# EAGLE design Knives_Controls (EAGLE 9.6.2)
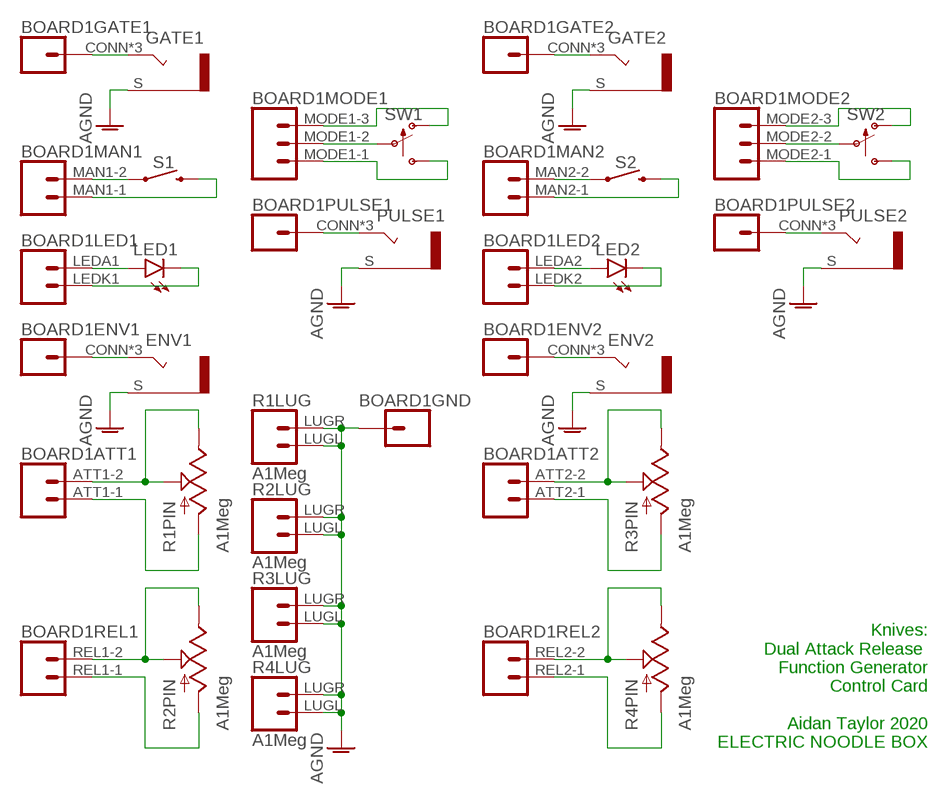
[diagram p0: schematic, sheet 1]

## Parts
BOARD1  KNIVES_LINK  [KNIVES]
ENV1  COMBI-JACKCINCHNANA  [NEWCOMBOJACK_PANEL]
ENV2  COMBI-JACKCINCHNANA  [NEWCOMBOJACK_PANEL]
GATE1  COMBI-JACKCINCHNANA  [NEWCOMBOJACK_PANEL]
GATE2  COMBI-JACKCINCHNANA  [NEWCOMBOJACK_PANEL]
LED1  LED3MM  [LED3MM]
LED2  LED3MM  [LED3MM]
PULSE1  COMBI-JACKCINCHNANA  [NEWCOMBOJACK_PANEL]
PULSE2  COMBI-JACKCINCHNANA  [NEWCOMBOJACK_PANEL]
R1  A1Meg  POTENTIOMETER  [ALPHA_RV09_9MMPOT]
R2  A1Meg  POTENTIOMETER  [ALPHA_RV09_9MMPOT]
R3  A1Meg  POTENTIOMETER  [ALPHA_RV09_9MMPOT]
R4  A1Meg  POTENTIOMETER  [ALPHA_RV09_9MMPOT]
S1  MCDTS-2_PUSHBUTTON  [MCDTS-2_PUSHBUTTON]
S2  MCDTS-2_PUSHBUTTON  [MCDTS-2_PUSHBUTTON]
SW1  SPDT_SWITCHDW1  [MICRODPDT-DW1]
SW2  SPDT_SWITCHDW1  [MICRODPDT-DW1]

## Nets
AGND: BOARD1.GND ENV1.S ENV2.S GATE1.S GATE2.S PULSE1.S PULSE2.S R1.LUGL R1.LUGR R2.LUGL R2.LUGR R3.LUGL R3.LUGR R4.LUGL R4.LUGR
N$1: BOARD1.G1 GATE1.CONN(T) GATE1.T1(T) GATE1.T2(T)
N$2: BOARD1.MAN1-2 S1.P$1 S1.P$2
N$3: BOARD1.MAN1-1 S1.P$3 S1.P$4
N$4: BOARD1.LEDA1 LED1.A
N$5: BOARD1.LEDK1 LED1.K(C)
N$6: BOARD1.EOUT1 ENV1.CONN(T) ENV1.T1(T) ENV1.T2(T)
N$7: BOARD1.ATT1-2 R1.C2(PIN:W) R1.C3(PIN:B)
N$8: BOARD1.ATT1-1 R1.C1(PIN:A)
N$9: BOARD1.REL1-2 R2.C2(PIN:W) R2.C3(PIN:B)
N$10: BOARD1.REL1-1 R2.C1(PIN:A)
N$11: BOARD1.MODE1-1 SW1.C3(S)
N$12: BOARD1.MODE1-2 SW1.C2(P)
N$13: BOARD1.MODE1-3 SW1.C1(O)
N$14: BOARD1.P1 PULSE1.CONN(T) PULSE1.T1(T) PULSE1.T2(T)
N$15: BOARD1.G2 GATE2.CONN(T) GATE2.T1(T) GATE2.T2(T)
N$16: BOARD1.MAN2-2 S2.P$1 S2.P$2
N$17: BOARD1.MAN2-1 S2.P$3 S2.P$4
N$18: BOARD1.LEDA2 LED2.A
N$19: BOARD1.LEDK2 LED2.K(C)
N$20: BOARD1.EOUT2 ENV2.CONN(T) ENV2.T1(T) ENV2.T2(T)
N$21: BOARD1.ATT2-2 R3.C2(PIN:W) R3.C3(PIN:B)
N$22: BOARD1.ATT2-1 R3.C1(PIN:A)
N$23: BOARD1.REL2-2 R4.C2(PIN:W) R4.C3(PIN:B)
N$24: BOARD1.REL2-1 R4.C1(PIN:A)
N$25: BOARD1.MODE2-1 SW2.C3(S)
N$26: BOARD1.MODE2-2 SW2.C2(P)
N$27: BOARD1.MODE2-3 SW2.C1(O)
N$28: BOARD1.P2 PULSE2.CONN(T) PULSE2.T1(T) PULSE2.T2(T)

## Notes on the sheet
- Knives:
  Dual Attack Release 
  Function Generator
  Control Card
  
  Aidan Taylor 2020
  ELECTRIC NOODLE BOX

## Library data of the parts
BOARD1 = ElectricNoodleBox:KNIVES_LINK
ENV1 ENV2 GATE1 GATE2 PULSE1 PULSE2 = ElectricNoodleBox:COMBI-JACK
LED1 LED2 = led:LED: LED OSRAM: - CHIPLED LG R971, LG N971, LY N971, LG Q971, LY Q971, LO R971, LY R971 LH N974, LH R974 LS Q976, LO Q976, LY Q976 LO Q996 - Hyper CHIPLED LW Q18S LB Q993, LB Q99A, LB R99A - SideLED LS A670, LO A670, LY A670, LG A670, LP A670 LB A673, LV A673, LT A673, LW A673 LH A674 LY A675 LS A676, LA A676, LO A676, LY A676, LW A676 LS A679, LY A679, LG A679 - Hyper Micro SIDELED® LS Y876, LA Y876, LO Y876, LY Y876 LT Y87S - SmartLED LW L88C, LW L88S LB L89C, LB L89S, LG L890 LS L89K, LO L89K, LY L89K LS L896, LA L896, LO L896, LY L896 - TOPLED LS T670, LO T670, LY T670, LG T670, LP T670 LSG T670, LSP T670, LSY T670, LOP T670, LYG T670 LG T671, LOG T671, LSG T671 LB T673, LV T673, LT T673, LW T673 LH T674 LS T676, LA T676, LO T676, LY T676, LB T676, LH T676, LSB T676, LW T676 LB T67C, LV T67C, LT T67C, LS T67K, LO T67K, LY T67K, LW E67C LS E67B, LA E67B, LO E67B, LY E67B, LB E67C, LV E67C, LT E67C LW T67C LS T679, LY T679, LG T679 LS T770, LO T770, LY T770, LG T770, LP T770 LB T773, LV T773, LT T773, LW T773 LH T774 LS E675, LA E675, LY E675, LS T675 LS T776, LA T776, LO T776, LY T776, LB T776 LHGB T686 LT T68C, LB T68C - Hyper Mini TOPLED® LB M676 - Mini TOPLED Santana® LG M470 LS M47K, LO M47K, LY M47K Source: http://www.osram.convergy.de LUXEON: - LUMILED® LXK2-PW12-R00, LXK2-PW12-S00, LXK2-PW14-U00, LXK2-PW14-V00 LXK2-PM12-R00, LXK2-PM12-S00, LXK2-PM14-U00 LXK2-PE12-Q00, LXK2-PE12-R00, LXK2-PE12-S00, LXK2-PE14-T00, LXK2-PE14-U00 LXK2-PB12-K00, LXK2-PB12-L00, LXK2-PB12-M00, LXK2-PB14-N00, LXK2-PB14-P00, LXK2-PB14-Q00 LXK2-PR12-L00, LXK2-PR12-M00, LXK2-PR14-Q00, LXK2-PR14-R00 LXK2-PD12-Q00, LXK2-PD12-R00, LXK2-PD12-S00 LXK2-PH12-R00, LXK2-PH12-S00 LXK2-PL12-P00, LXK2-PL12-Q00, LXK2-PL12-R00 Source: www.luxeon.com KINGBRIGHT: KA-3528ASYC Source: www.kingbright.com
R1-R4 = ElectricNoodleBox:POTENTIOMETER
S1 S2 = ElectricNoodleBox:MCDTS-2_PUSHBUTTON
SW1 SW2 = ElectricNoodleBox:SPDT_SWITCH

## Board
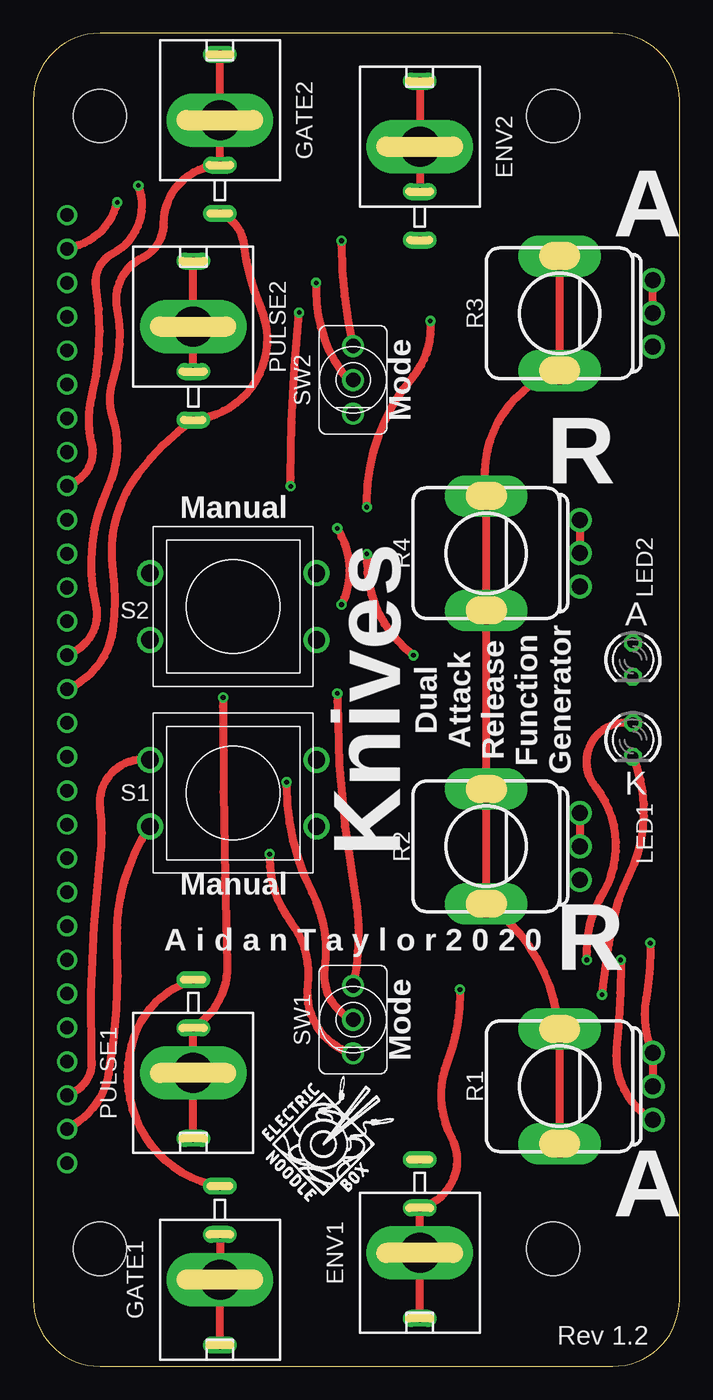
[diagram p1: board, top side]
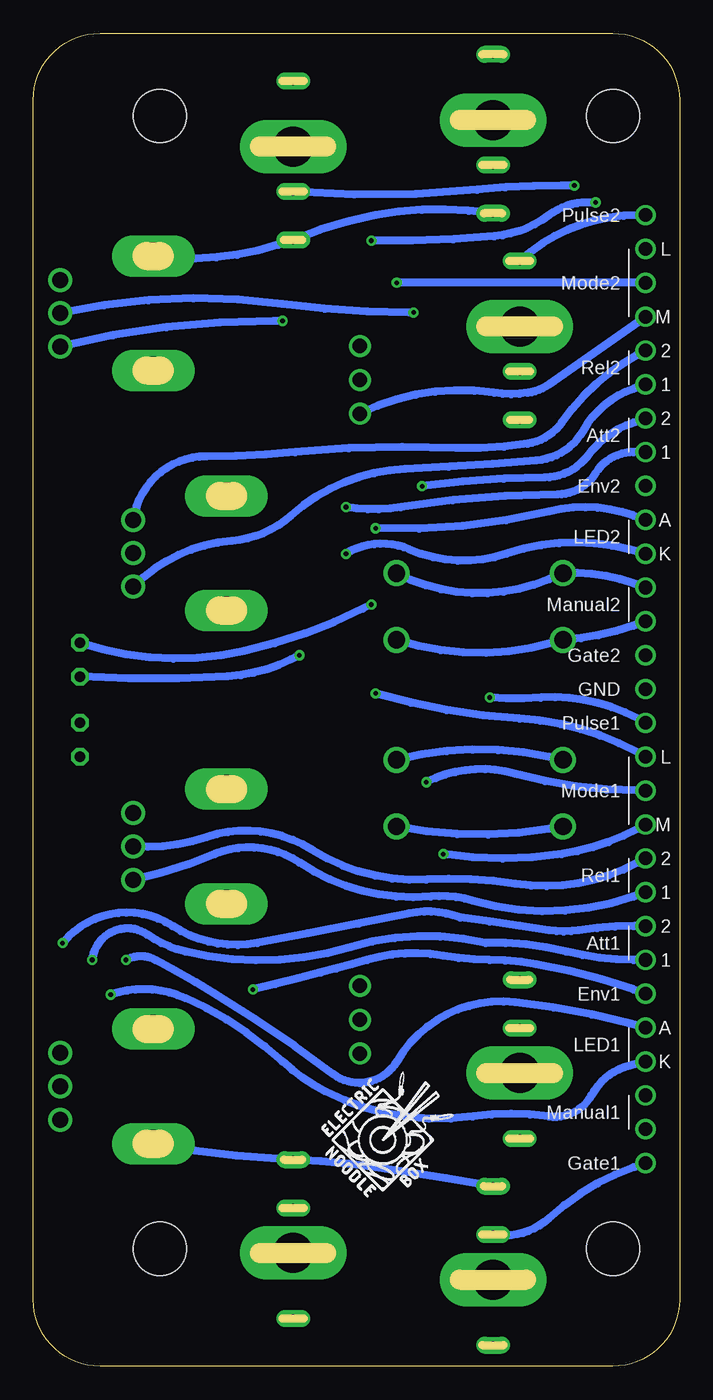
[diagram p2: board, bottom side, seen from below]

Size 48.5 x 100 mm. Coordinates in mm from the lower left corner, seen from the top.
Outline: 48.5,5 48.5,95 arc90 43.5,100 5,100 arc90 0,95 0,5 arc90 5,0 43.5,0 arc90 48.5,5
Copper layers (1*16): Top 0.035mm / dielectric 1.5mm / Bottom 0.035mm
Design rules "default": minimum track width 6mil, minimum drill 0.35mm, track to track 6mil, track to pad 6mil, pad to pad 6mil, via to via 6mil, smd to smd 6mil, copper to edge 40mil, drill to drill 6mil, minimum pad ring 10mil, minimum via ring 8mil, stop-mask expansion 4mil, vias tented up to drill 0mil, thermal gap 10mil

### Footprints (pad centres in the part's own frame; a part is rotated, then mirrored left to right if it is on the bottom)
KNIVES = drill 1.016: ATT1-1 26.67,2.54; ATT1-2 29.21,2.54; ATT2-1 64.77,2.54; ATT2-2 67.31,2.54; EOUT1 24.13,2.54; EOUT2 62.23,2.54; G1 11.43,2.54; G2 49.53,2.54; GND 46.99,2.54; LEDA1 21.59,2.54; LEDA2 59.69,2.54; LEDK1 19.05,2.54; LEDK2 57.15,2.54; MAN1-1 13.97,2.54; MAN1-2 16.51,2.54; MAN2-1 52.07,2.54; MAN2-2 54.61,2.54; MODE1-1 36.83,2.54; MODE1-2 39.37,2.54; MODE1-3 41.91,2.54; MODE2-1 74.93,2.54; MODE2-2 77.47,2.54; MODE2-3 80.01,2.54; P1 44.45,2.54; P2 82.55,2.54; REL1-1 31.75,2.54; REL1-2 34.29,2.54; REL2-1 69.85,2.54; REL2-2 72.39,2.54 | hole 4: 5,5; 90,5; 90,39; 5,39
NEWCOMBOJACK_PANEL = drill 3 pad 3.6 long: CONN 0,0 | drill 0.6 pad 1.27 long: S 0,-7; T1 0,4.92; T2 0,-3.38
LED3MM = drill 0.813 octagon: A -1.27,0; K 1.27,0
ALPHA_RV09_9MMPOT = drill 1.2 pad 1.778: C1 -2.5,-7; C2 0,-7; C3 2.5,-7 | drill 2.1 pad 2.8 long: LUGL -4.3,0; LUGR 4.3,0
MCDTS-2_PUSHBUTTON = drill 1.3: P$1 -6.25,-2.5; P$2 6.25,-2.5; P$3 -6.25,2.5; P$4 6.25,2.5
MICRODPDT-DW1 = drill 1.1: C1 0,-2.54; C2 0,0; C3 0,2.54

### Placement (x,y rotation side)
BOARD1  0,3.81 90 bottom
ENV1  29,8.5 180 top
ENV2  29,91.5 0 top
GATE1  14,6.5 180 top
GATE2  14,93.5 0 top
LED1  45,47 270 top
LED2  45,53 270 top
PULSE1  12,22 180 top
PULSE2  12,78 0 top
R1  39.5,21 90 top
R2  34,39 90 top
R3  39.5,79 90 top
R4  34,61 90 top
S1  15,43 180 top
S2  15,57 180 top
SW1  24,26 180 top
SW2  24,74 180 top
U$1  [LOGO10X10]  17.1,12.06 0 top
U$2  [LOGO10X10]  26.94,12.38 0 bottom

### Tracks (layer width: path | path; a pad name or v marks a point on that pad's centre or on a via)
AGND
  Top 0.61: BOARD1.GND 3.13,51.12 arc54 5.99,55.24 arc16 5.99,59.69 arc-45 7.89,66.99 arc-17 PULSE2.S 12.65,71.12 arc103 17.1,79.38 arc-16 15.83,84.14 arc62 GATE2.S | PULSE1.S 11.06,28.57 arc46 7.57,24.77 arc31 7.26,20 arc68 GATE1.S | R1.LUGL R1.LUGR 39.32,26.35 arc46 R2.LUGL R2.LUGR R4.LUGL R4.LUGR 33.92,66.36 arc-76 R3.LUGL R3.LUGR
  Bottom 0.61: GATE1.S 14.88,13.65 arc-2 22.81,14.92 arc-6 ENV1.S 30.11,15.56 arc8 R1.LUGL | GATE2.S 15.83,86.68 arc-16 22.81,86.36 arc-12 ENV2.S 30.11,84.14 arc26 R3.LUGR
N$1
  Top 0.61: GATE1.T1 GATE1.CONN GATE1.T2
  Bottom 0.61: BOARD1.G1 3.45,14.92 arc-23 9.79,11.11 arc53 GATE1.T2
N$2
  Top 0.61: BOARD1.MAN1-2 3.13,20.64 arc64 4.4,22.86 arc-9 5.03,38.1 arc14 5.03,41.91 arc-106 S1.P$2
  Bottom 0.61: S1.P$2 9.79,45.72 arc-26 S1.P$1
N$3
  Top 0.61: BOARD1.MAN1-1 3.45,18.41 arc45 5.67,21.91 arc13 6.3,31.75 arc-36 S1.P$4
  Bottom 0.61: S1.P$4 9.79,40.32 arc21 S1.P$3
N$4  (via drill 0.35)
  Top 0.61: LED1.A arc138 42.18,43.5 arc-68 42.81,35.56 arc32 41.55,31.11 v41.55,30.48
  Bottom 0.61: BOARD1.LEDA1 3.76,25.72 arc-8 12.34,27.3 arc-66 21.23,22.86 arc96 25.99,21.91 arc-6 34.88,27.94 arc-3 39.32,30.48 arc-56 v41.55,30.48
N$5  (via drill 0.35)
  Top 0.61: v42.69,27.88 42.81,28.89 arc-3 43.45,33.02 arc-16 44.72,36.83 arc49 LED1.K
  Bottom 0.61: BOARD1.LEDK1 3.76,22.54 arc-47 6.62,20.32 arc69 9.79,18.73 arc-16 15.51,18.73 arc36 26.62,20.64 arc15 29.8,22.86 arc-19 37.1,27.62 arc-42 v42.69,27.88
N$6  (via drill 0.35)
  Top 0.61: v32.02,28.26 32.02,27.94 arc-21 31.07,22.86 arc49 31.38,17.14 arc-104 ENV1.T2 ENV1.CONN ENV1.T1
  Bottom 0.61: BOARD1.EOUT1 3.45,28.26 arc-9 10.75,30.16 arc-9 14.24,30.48 arc9 17.73,30.8 arc-26 23.45,30.48 arc2 26.94,29.53 arc0 v32.02,28.26
N$7  (via drill 0.35)
  Top 0.61: v46.31,31.75 46.31,31.11 arc-10 45.99,27.62 arc35 R1.C3 R1.C2
  Bottom 0.61: BOARD1.ATT1-2 3.45,33.02 arc-9 7.57,32.7 arc18 9.79,32.7 arc-1 16.46,33.66 arc-33 20.27,33.97 arc1 31.7,31.75 arc44 38.05,33.02 arc-84 v46.31,31.75
N$8  (via drill 0.35)
  Top 0.61: v44.09,30.48 44.09,30.16 arc-6 43.77,23.81 arc66 R1.C1
  Bottom 0.61: BOARD1.ATT1-1 3.45,30.48 arc14 8.53,31.11 arc-16 14.56,31.75 arc-30 24.72,31.43 arc30 37.1,31.11 arc21 39.96,32.38 arc-118 v44.09,30.48
N$9
  Top 0.61: R2.C3 R2.C2
  Bottom 0.61: BOARD1.REL1-2 3.13,37.78 arc37 12.34,36.2 arc-12 19,36.51 arc36 27.57,38.73 arc-51 35.51,39.69 arc23 R2.C2
N$10
  Bottom 0.61: BOARD1.REL1-1 3.45,35.24 arc36 15.51,34.92 arc-21 18.68,35.24 arc39 28.53,37.78 arc-56 34.88,38.42 arc10 R2.C1
N$11  (via drill 0.35)
  Top 0.61: v17.73,38.42 17.73,38.1 arc37 19.32,33.34 arc-44 20.59,28.57 arc81 SW1.C3
  Bottom 0.61: BOARD1.MODE1-1 3.13,40.32 arc20 8.84,38.42 arc17 v17.73,38.42
N$12  (via drill 0.35)
  Top 0.61: v19,43.81 19,43.5 arc27 20.91,35.56 arc-35 21.86,29.84 arc74 SW1.C2
  Bottom 0.61: BOARD1.MODE1-2 3.13,43.18 arc16 12.34,44.45 arc-42 v19,43.81
N$13  (via drill 0.35)
  Top 0.61: v22.81,50.48 22.81,49.85 arc10 24.08,35.88 arc-22 SW1.C1
  Bottom 0.61: BOARD1.MODE1-3 3.13,46.04 arc-25 12.02,48.58 arc13 v22.81,50.48
N$14  (via drill 0.35)
  Top 0.61: v14.24,50.16 14.24,49.53 arc2 14.56,30.16 arc-60 PULSE1.T2 PULSE1.CONN PULSE1.T1
  Bottom 0.61: BOARD1.P1 3.13,48.58 arc-32 10.43,50.16 arc8 v14.24,50.16
N$15
  Top 0.61: BOARD1.G2 3.13,53.66 arc74 4.71,57.15 arc-38 5.67,66.04 arc43 5.99,71.12 arc-36 5.99,73.98 arc29 6.3,79.38 arc-75 8.21,83.19 arc64 9.79,85.72 arc-88 GATE2.T2 GATE2.CONN GATE2.T1
N$16
  Bottom 0.61: BOARD1.MAN2-2 3.45,58.74 arc-22 S2.P$2 9.79,59.05 arc51 S2.P$1
N$17
  Bottom 0.61: BOARD1.MAN2-1 3.45,55.56 arc16 S2.P$4 9.48,54.29 arc34 S2.P$3
N$18  (via drill 0.35)
  Top 0.61: v22.81,62.87 23.13,62.23 arc-53 v23.13,57.15
  Bottom 0.61: BOARD1.LEDA2 3.45,63.82 arc-33 9.79,64.14 arc16 v22.81,62.87 | v23.13,57.15 23.77,56.83 arc14 32.66,53.66 arc31 LED2.A
N$19  (via drill 0.35)
  Top 0.61: v25.03,60.94 25.04,60.33 arc53 v28.53,53.34
  Bottom 0.61: BOARD1.LEDK2 3.76,61.28 arc-33 12.97,60.96 arc42 20.27,61.28 arc-55 25.04,60.96 arc-125 v25.03,60.94 | v28.53,53.34 29.16,53.02 arc23 33.92,51.75 arc6 LED2.K
N$20  (via drill 0.35)
  Top 0.61: BOARD1.EOUT2 3.13,66.36 arc75 4.4,69.22 arc-27 4.4,72.71 arc23 4.71,80.96 arc-72 5.99,83.5 arc84 v7.89,88.58 | ENV2.T1 ENV2.CONN ENV2.T2
  Bottom 0.61: v7.89,88.58 8.84,88.58 arc-6 15.19,88.27 arc10 ENV2.T2
N$21  (via drill 0.35)
  Top 0.61: v19.32,66.02 19.32,66.67 arc-6 v19.95,79.06 | R3.C2 R3.C3
  Bottom 0.61: BOARD1.ATT2-2 3.45,70.8 arc-33 6.94,68.26 arc52 10.11,66.67 arc-7 19.32,66.04 arc-173 v19.32,66.02 | v19.95,79.06 20.27,79.06 arc8 29.8,79.69 arc-20 R3.C2
N$22  (via drill 0.35)
  Top 0.61: v25.04,64.45 25.04,64.77 arc-40 28.53,74.3 arc46 v29.8,78.42
  Bottom 0.61: BOARD1.ATT2-1 3.45,68.58 arc-58 6.3,66.99 arc58 9.16,65.41 arc-9 20.91,64.45 arc19 v25.04,64.45 | v29.8,78.42 30.43,78.42 arc-14 R3.C1
N$23
  Top 0.61: R4.C3 R4.C2
  Bottom 0.61: BOARD1.REL2-2 3.13,75.88 arc-26 8.84,70.8 arc46 11.38,69.22 arc12 16.78,68.9 arc-8 28.84,68.58 arc5 35.51,68.26 arc-82 R4.C3
N$24
  Bottom 0.61: BOARD1.REL2-1 3.45,73.34 arc-41 7.26,70.17 arc56 10.75,67.94 arc2 20.59,67.31 arc-39 29.16,63.82 arc37 33.61,61.91 arc-40 R4.C1
N$25
  Bottom 0.61: BOARD1.MODE2-1 3.45,78.11 9.79,73.66 arc26 11.38,73.03 arc17 13.92,73.03 arc-35 SW2.C3
N$26  (via drill 0.35)
  Top 0.61: v21.23,81.28 21.23,80.64 arc35 23.13,74.61 arc40 SW2.C2
  Bottom 0.61: BOARD1.MODE2-2 v21.23,81.28
N$27  (via drill 0.35)
  Top 0.61: BOARD1.MODE2-3 3.45,84.14 arc57 v6.3,87.31 | v23.13,84.44 23.13,84.14 arc13 SW2.C1
  Bottom 0.61: v6.3,87.31 6.94,87.31 arc-37 9.79,86.36 arc32 13.92,84.77 arc6 23.13,84.45 arc-186 v23.13,84.44
N$28
  Top 0.61: PULSE2.T2 PULSE2.CONN PULSE2.T1
  Bottom 0.61: BOARD1.P2 3.13,86.36 arc-42 PULSE2.T1

### Text on the board
tPlace: A | Mode | R | Manual | A | Knives | Dual / Attack / Release / Function / Generator | K | Manual | A i d a n T a y l o r 2 0 2 0 | R | Mode | A | Rev 1.2